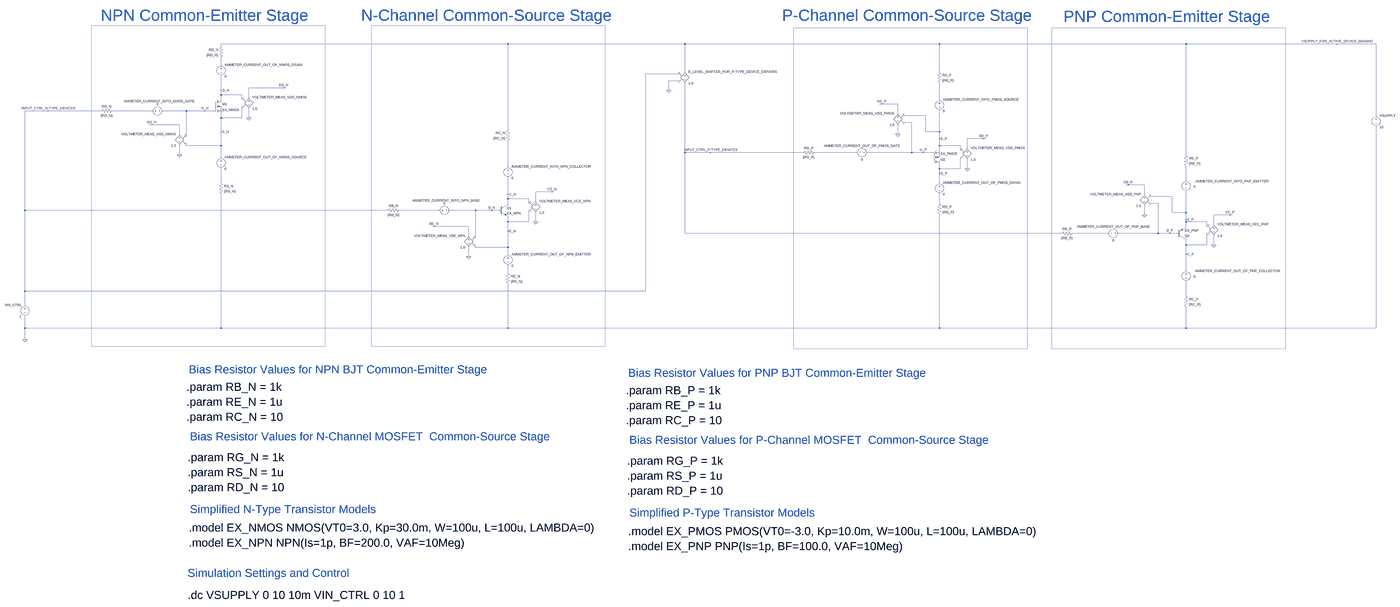
[diagram p0: schematic Common_Emitter_Common_Source_Test_Bench_for_Beginners.asc, whole sheet]
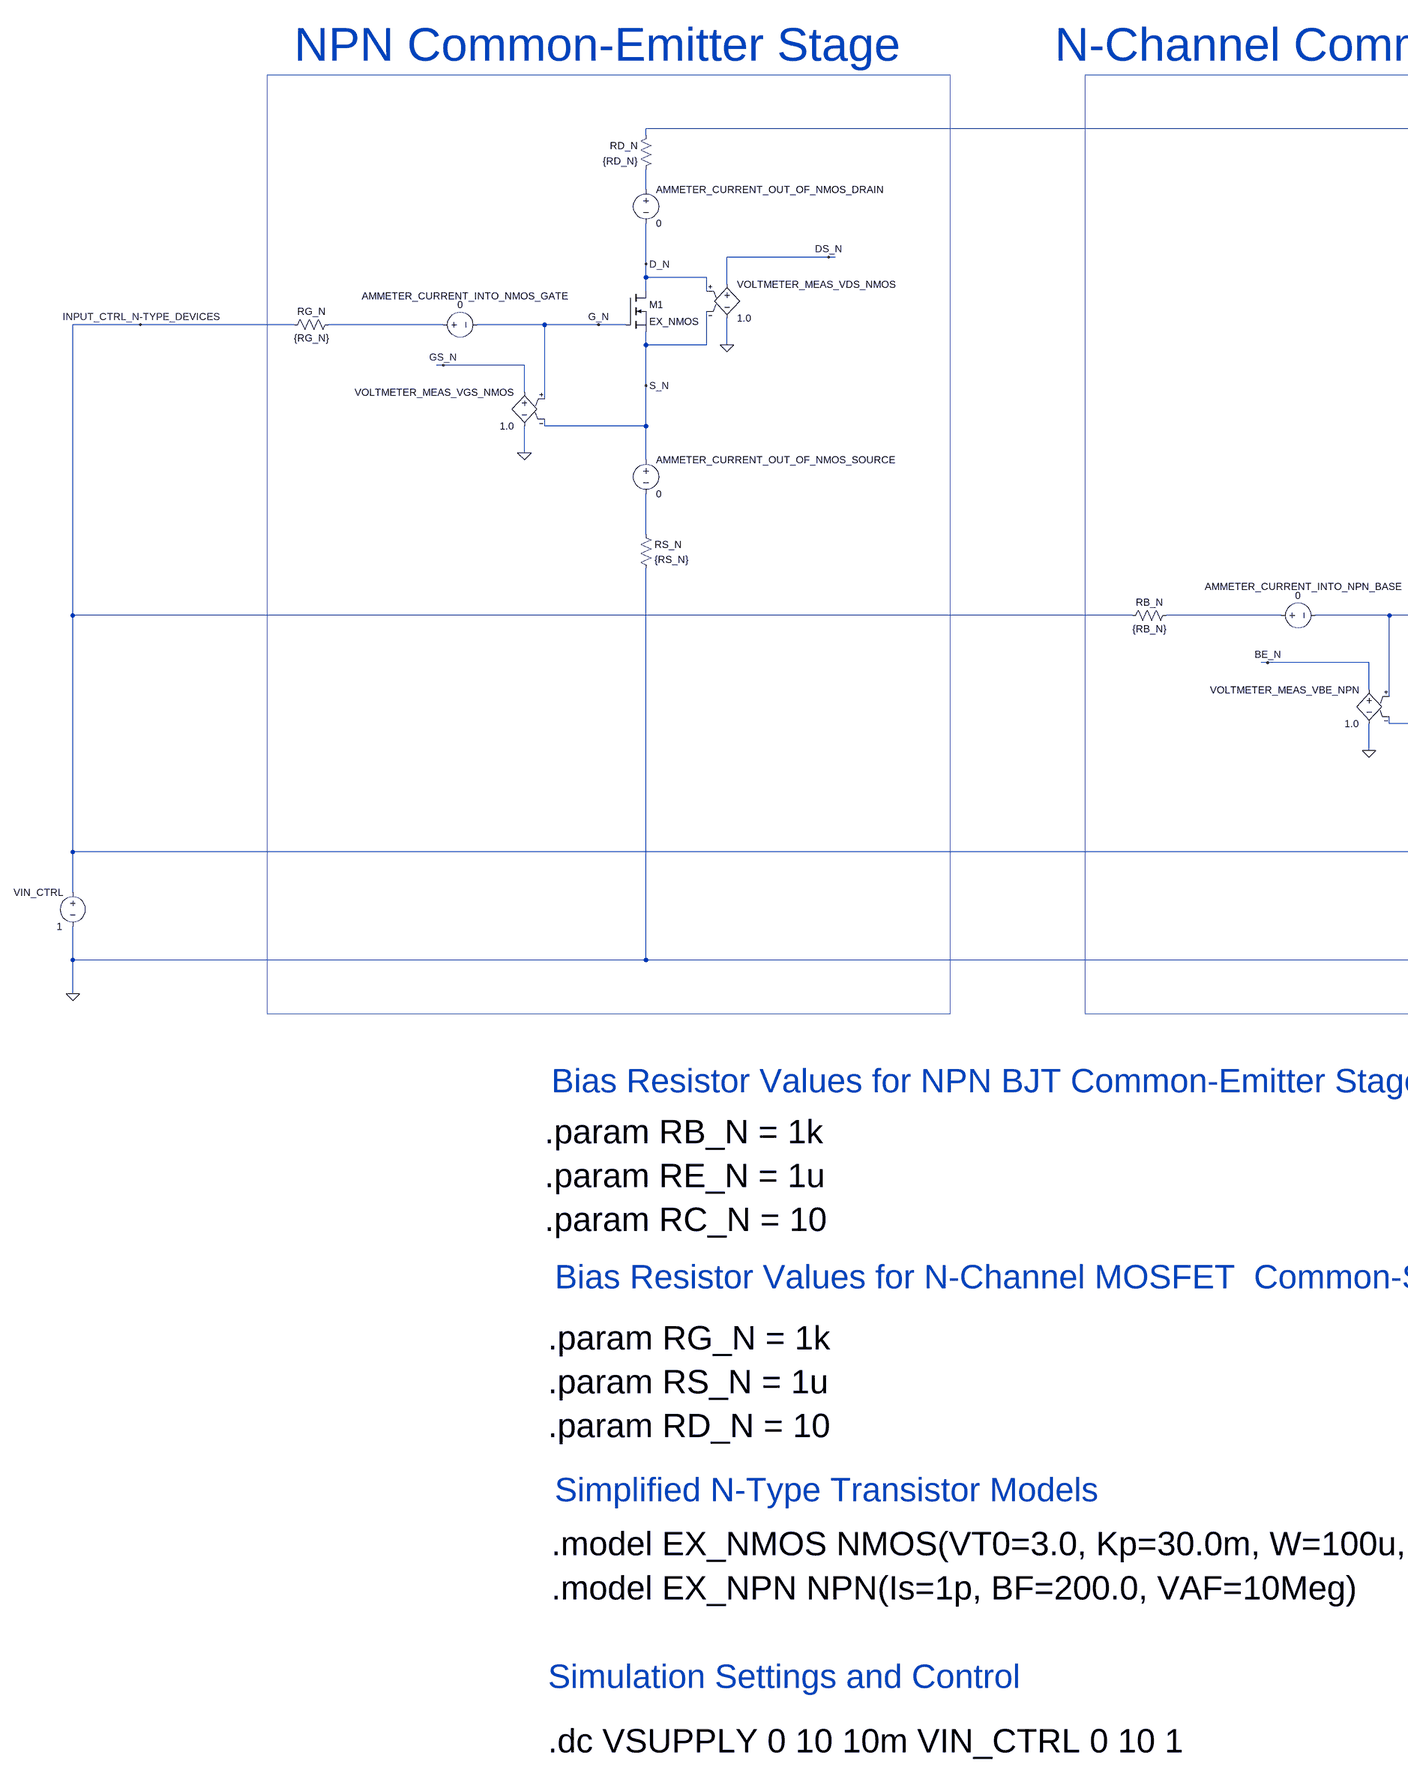
[diagram p1: schematic Common_Emitter_Common_Source_Test_Bench_for_Beginners.asc, part, row 1 of 1, column 1 of 3]
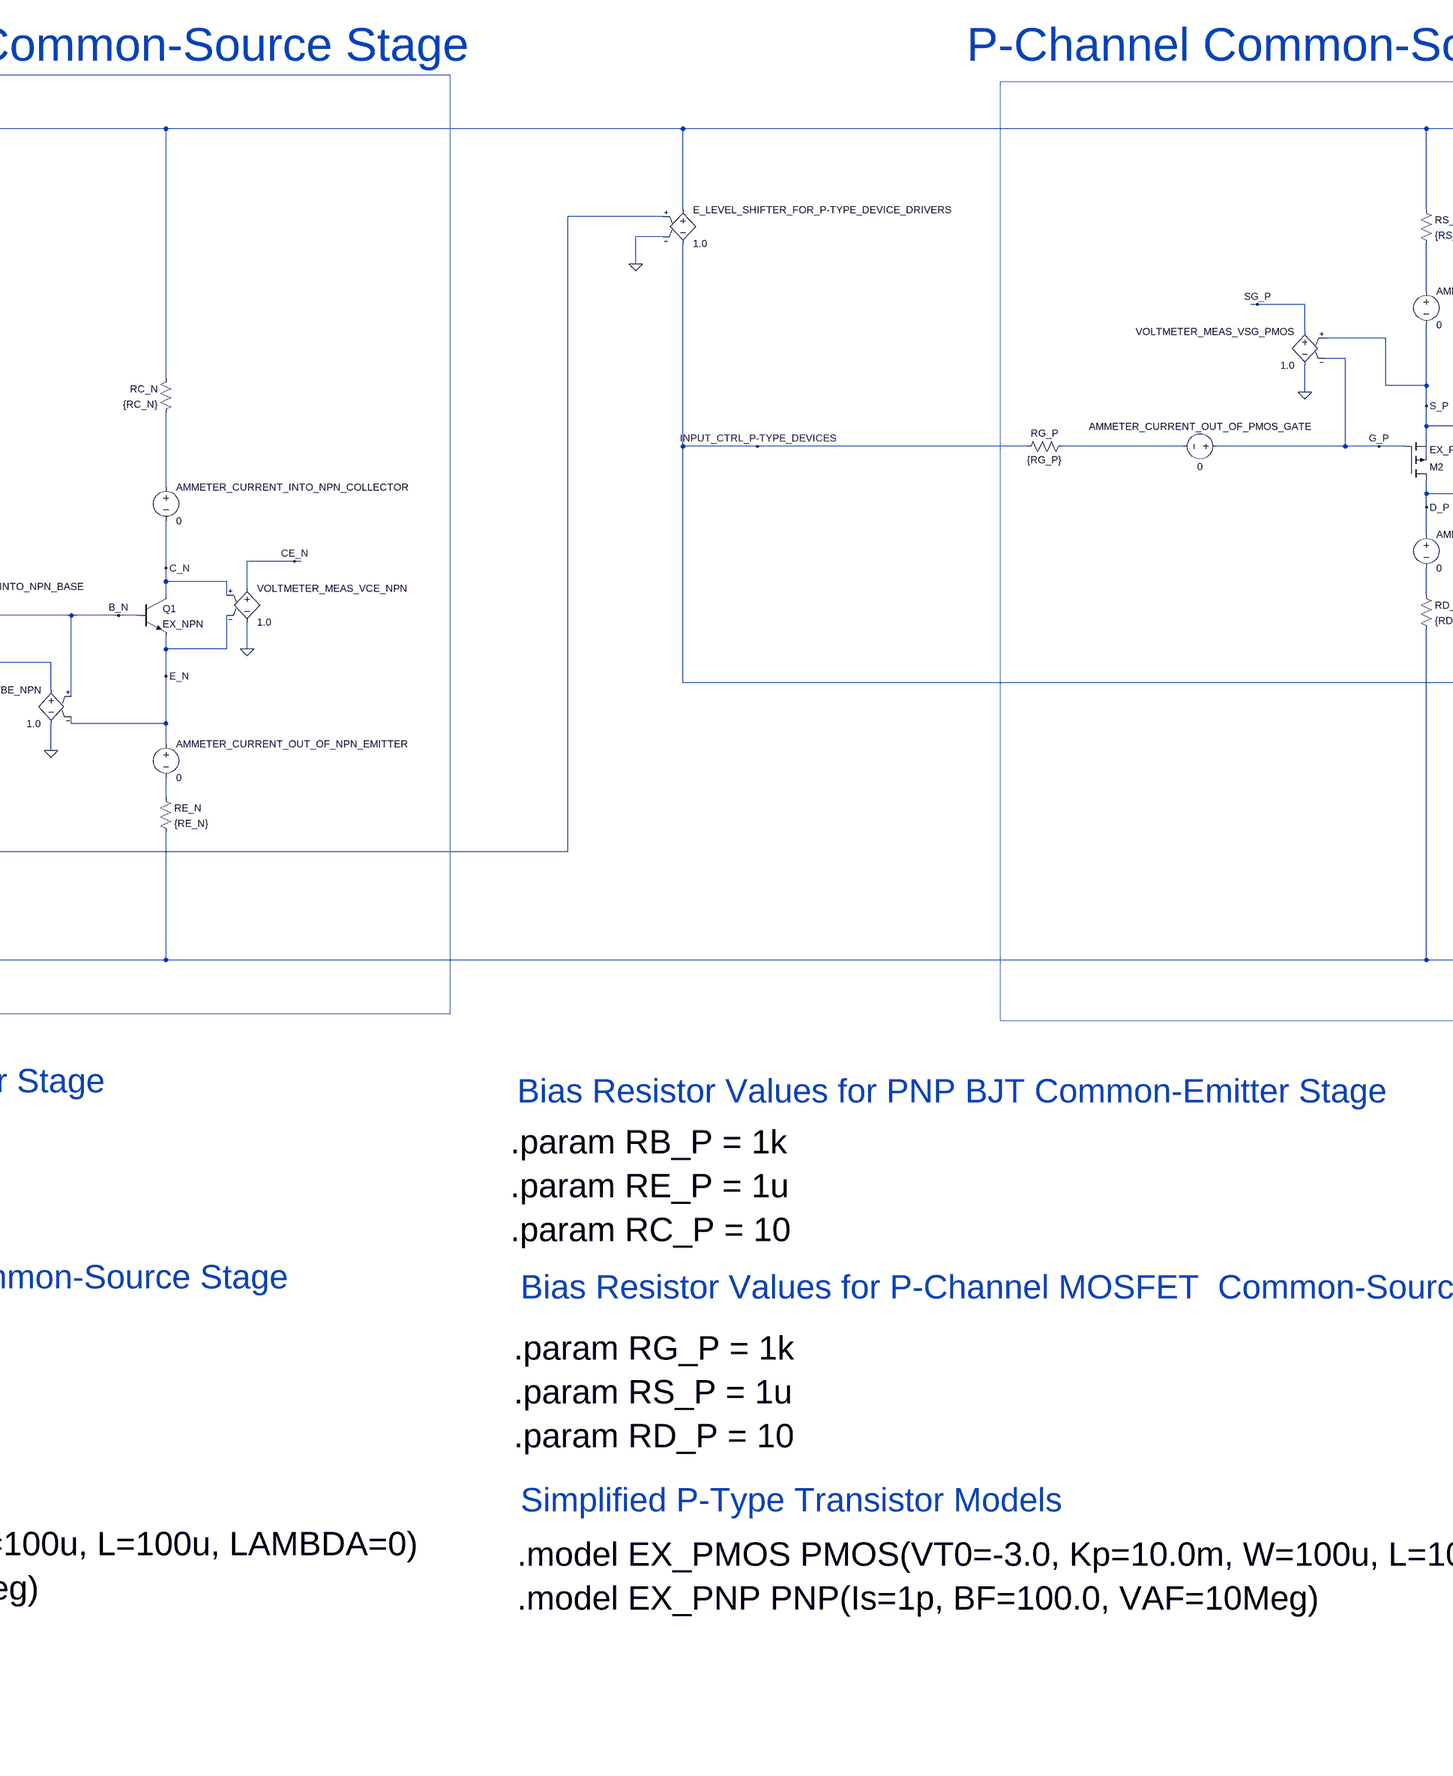
[diagram p2: schematic Common_Emitter_Common_Source_Test_Bench_for_Beginners.asc, part, row 1 of 1, column 2 of 3]
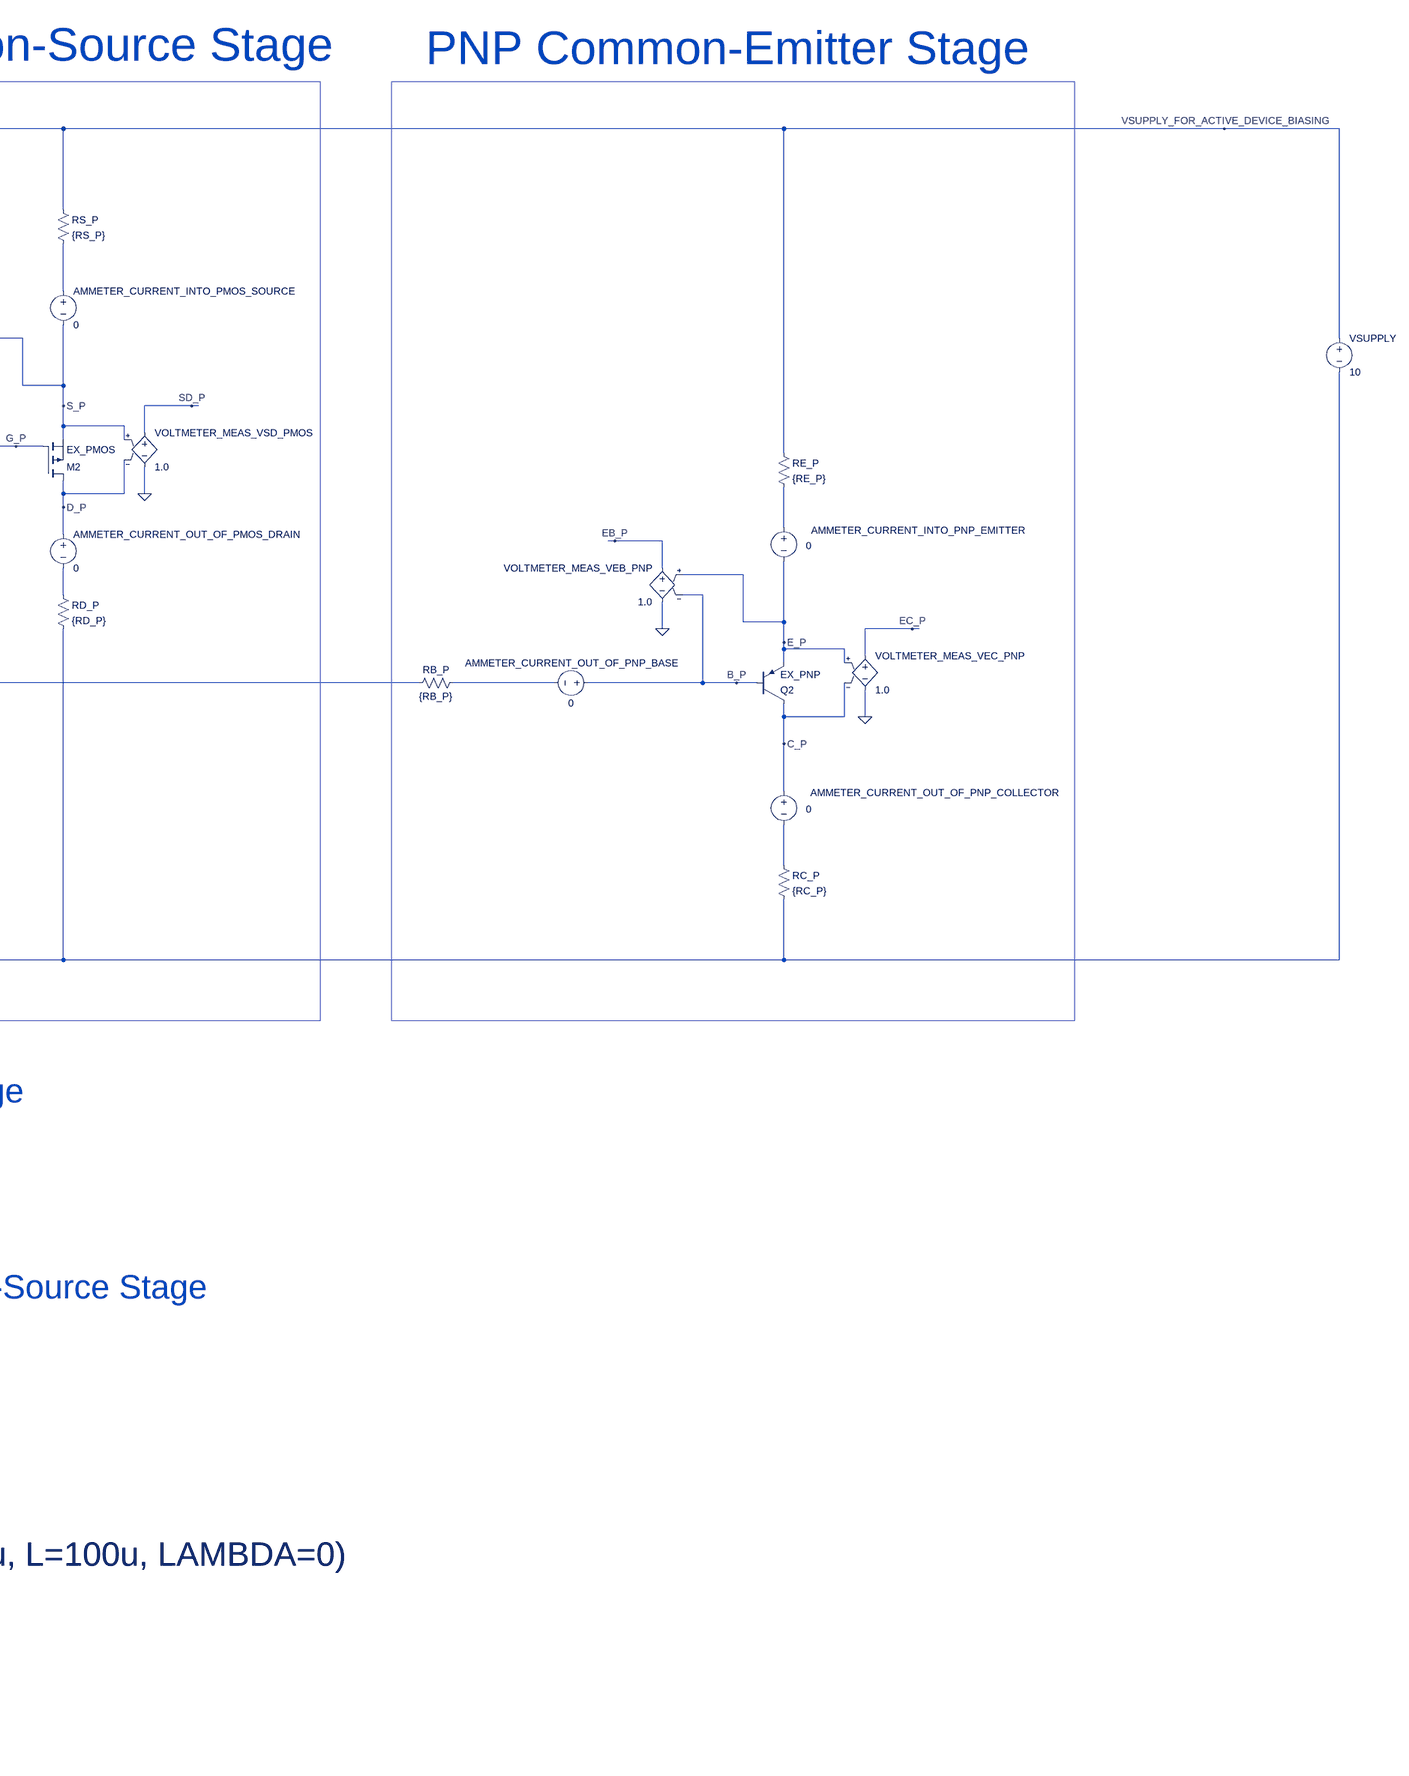
[diagram p3: schematic Common_Emitter_Common_Source_Test_Bench_for_Beginners.asc, part, row 1 of 1, column 3 of 3]
Common_Emitter_Common_Source_Test_Bench_for_Beginners.asc, the LTspice schematic file:
Version 4.1
SHEET 1 8076 3632
WIRE 768 -784 -1216 -784
WIRE 2368 -784 768 -784
WIRE 4128 -784 2368 -784
WIRE 6176 -784 4128 -784
WIRE 7664 -784 6176 -784
WIRE 7936 -784 7664 -784
WIRE -1216 -768 -1216 -784
WIRE -1216 -640 -1216 -688
WIRE 2368 -592 2368 -784
WIRE 4128 -592 4128 -784
WIRE 2320 -576 2096 -576
WIRE 2320 -528 2256 -528
WIRE -784 -480 -1024 -480
WIRE -768 -480 -784 -480
WIRE -1216 -464 -1216 -560
WIRE 2256 -464 2256 -528
WIRE -1216 -432 -1216 -464
WIRE -1072 -432 -1216 -432
WIRE -1024 -416 -1024 -480
WIRE -1216 -400 -1216 -432
WIRE -1072 -400 -1072 -432
WIRE 4128 -400 4128 -512
WIRE 3728 -368 3712 -368
WIRE 3840 -368 3728 -368
WIRE -2864 -320 -3024 -320
WIRE -2048 -320 -2864 -320
WIRE -1696 -320 -1968 -320
WIRE -1456 -320 -1616 -320
WIRE -1328 -320 -1456 -320
WIRE -1264 -320 -1328 -320
WIRE 3840 -304 3840 -368
WIRE 4032 -288 3888 -288
WIRE 7936 -288 7936 -784
WIRE -1216 -272 -1216 -304
WIRE -1072 -272 -1072 -352
WIRE -1072 -272 -1216 -272
WIRE -1024 -272 -1024 -336
WIRE 3936 -240 3888 -240
WIRE -1696 -224 -1712 -224
WIRE -1504 -224 -1696 -224
WIRE 768 -192 768 -784
WIRE -1216 -176 -1216 -272
WIRE 4032 -176 4032 -288
WIRE 4128 -176 4128 -320
WIRE 4128 -176 4032 -176
WIRE -1504 -160 -1504 -224
WIRE 3840 -160 3840 -224
WIRE -1456 -144 -1456 -320
WIRE 4128 -128 4128 -176
WIRE 4432 -128 4320 -128
WIRE 4448 -128 4432 -128
WIRE -1456 -80 -1456 -96
WIRE -1216 -80 -1216 -176
WIRE -1216 -80 -1456 -80
WIRE 4128 -80 4128 -128
WIRE 4272 -80 4128 -80
WIRE 4320 -64 4320 -128
WIRE 4128 -48 4128 -80
WIRE 4272 -48 4272 -80
WIRE 2368 -32 2368 -512
WIRE 2544 -32 2368 -32
WIRE 3184 -32 2544 -32
WIRE 3552 -32 3264 -32
WIRE 3936 -32 3936 -240
WIRE 3936 -32 3632 -32
WIRE 4016 -32 3936 -32
WIRE 4080 -32 4016 -32
WIRE -1504 -16 -1504 -80
WIRE 6176 -16 6176 -784
WIRE -1216 0 -1216 -80
WIRE 768 64 768 -112
WIRE 4128 80 4128 48
WIRE 4272 80 4272 0
WIRE 4272 80 4128 80
WIRE 4320 80 4320 16
WIRE 4128 112 4128 80
WIRE 6176 160 6176 64
WIRE -1216 176 -1216 80
WIRE 4128 176 4128 112
WIRE 5776 192 5760 192
WIRE 5888 192 5776 192
WIRE 1072 240 960 240
WIRE 1088 240 1072 240
WIRE 768 256 768 144
WIRE 5888 256 5888 192
WIRE 6080 272 5936 272
WIRE 768 288 768 256
WIRE 912 288 768 288
WIRE 960 304 960 240
WIRE 768 320 768 288
WIRE 912 320 912 288
WIRE 4128 320 4128 256
WIRE 5984 320 5936 320
WIRE -3024 368 -3024 -320
WIRE -64 368 -3024 368
WIRE 288 368 16 368
WIRE 544 368 368 368
WIRE 656 368 544 368
WIRE 704 368 656 368
WIRE 6080 384 6080 272
WIRE 6176 384 6176 240
WIRE 6176 384 6080 384
WIRE 5888 400 5888 336
WIRE 6480 400 6368 400
WIRE 6496 400 6480 400
WIRE 6176 432 6176 384
WIRE 768 448 768 416
WIRE 912 448 912 368
WIRE 912 448 768 448
WIRE 960 448 960 384
WIRE 6176 448 6176 432
WIRE 6320 448 6176 448
WIRE 6368 464 6368 400
WIRE 256 480 240 480
WIRE 496 480 256 480
WIRE 6176 480 6176 448
WIRE 6320 480 6320 448
WIRE 768 512 768 448
WIRE 2368 528 2368 -32
WIRE 5312 528 2368 528
WIRE 5632 528 5392 528
WIRE 5984 528 5984 320
WIRE 5984 528 5712 528
WIRE 6064 528 5984 528
WIRE 6112 528 6064 528
WIRE 496 544 496 480
WIRE 544 560 544 368
WIRE 6176 608 6176 576
WIRE 6320 608 6320 528
WIRE 6320 608 6176 608
WIRE 6368 608 6368 544
WIRE 544 624 544 608
WIRE 768 624 768 512
WIRE 768 624 544 624
WIRE 768 672 768 624
WIRE 6176 672 6176 608
WIRE 496 688 496 624
WIRE 6176 784 6176 672
WIRE 768 800 768 752
WIRE -3024 928 -3024 368
WIRE 2096 928 2096 -576
WIRE 2096 928 -3024 928
WIRE 6176 960 6176 864
WIRE -3024 1024 -3024 928
WIRE -3024 1184 -3024 1104
WIRE -1216 1184 -1216 256
WIRE -1216 1184 -3024 1184
WIRE 768 1184 768 880
WIRE 768 1184 -1216 1184
WIRE 4128 1184 4128 400
WIRE 4128 1184 768 1184
WIRE 6176 1184 6176 1040
WIRE 6176 1184 4128 1184
WIRE 7936 1184 7936 -208
WIRE 7936 1184 6176 1184
WIRE -3024 1264 -3024 1184
FLAG 656 368 B_N
FLAG -1328 -320 G_N
FLAG -1216 -464 D_N
FLAG 768 256 C_N
FLAG -3024 1264 0
FLAG 7664 -784 VSUPPLY_FOR_ACTIVE_DEVICE_BIASING
FLAG -2864 -320 INPUT_CTRL_N-TYPE_DEVICES
FLAG 960 448 0
FLAG 1072 240 CE_N
FLAG -1024 -272 0
FLAG -784 -480 DS_N
FLAG -1216 -176 S_N
FLAG 768 512 E_N
FLAG -1504 -16 0
FLAG -1696 -224 GS_N
FLAG 496 688 0
FLAG 256 480 BE_N
FLAG 2256 -464 0
FLAG 4016 -32 G_P
FLAG 4128 112 D_P
FLAG 4128 -128 S_P
FLAG 6064 528 B_P
FLAG 6176 672 C_P
FLAG 6176 432 E_P
FLAG 4320 80 0
FLAG 4432 -128 SD_P
FLAG 6368 608 0
FLAG 6480 400 EC_P
FLAG 5888 400 0
FLAG 5776 192 EB_P
FLAG 3840 -160 0
FLAG 3728 -368 SG_P
FLAG 2544 -32 INPUT_CTRL_P-TYPE_DEVICES
SYMBOL npn 704 320 R0
SYMATTR InstName Q1
SYMATTR Value EX_NPN
SYMBOL nmos -1264 -400 R0
SYMATTR InstName M1
SYMATTR Value EX_NMOS
SYMBOL res -80 384 R270
WINDOW 0 32 56 VTop 2
WINDOW 3 0 56 VBottom 2
SYMATTR InstName RB_N
SYMATTR Value {RB_N}
SYMBOL res -2064 -304 R270
WINDOW 0 32 56 VTop 2
WINDOW 3 0 56 VBottom 2
SYMATTR InstName RG_N
SYMATTR Value {RG_N}
SYMBOL voltage -3024 1008 M0
WINDOW 123 0 0 Left 0
WINDOW 39 0 0 Left 0
SYMATTR InstName VIN_CTRL
SYMATTR Value 1
SYMBOL res -1200 -784 M0
SYMATTR InstName RD_N
SYMATTR Value {RD_N}
SYMBOL res 784 -208 M0
SYMATTR InstName RC_N
SYMATTR Value {RC_N}
SYMBOL voltage 7936 -304 R0
WINDOW 123 0 0 Left 0
WINDOW 39 0 0 Left 0
SYMATTR InstName VSUPPLY
SYMATTR Value 10
SYMBOL res 752 784 R0
SYMATTR InstName RE_N
SYMATTR Value {RE_N}
SYMBOL res -1232 160 R0
SYMATTR InstName RS_N
SYMATTR Value {RS_N}
SYMBOL e 960 288 R0
SYMATTR InstName VOLTMETER_MEAS_VCE_NPN
SYMATTR Value 1.0
SYMBOL e -1024 -432 R0
SYMATTR InstName VOLTMETER_MEAS_VDS_NMOS
SYMATTR Value 1.0
SYMBOL e -1504 -176 M0
SYMATTR InstName VOLTMETER_MEAS_VGS_NMOS
SYMATTR Value 1.0
SYMBOL e 496 528 M0
SYMATTR InstName VOLTMETER_MEAS_VBE_NPN
SYMATTR Value 1.0
SYMBOL e 2368 -608 R0
SYMATTR InstName E_LEVEL_SHIFTER_FOR_P-TYPE_DEVICE_DRIVERS
SYMATTR Value 1.0
SYMBOL res 5408 512 R90
WINDOW 0 0 56 VBottom 2
WINDOW 3 32 56 VTop 2
SYMATTR InstName RB_P
SYMATTR Value {RB_P}
SYMBOL res 3280 -48 R90
WINDOW 0 0 56 VBottom 2
WINDOW 3 32 56 VTop 2
SYMATTR InstName RG_P
SYMATTR Value {RG_P}
SYMBOL res 4112 304 R0
SYMATTR InstName RD_P
SYMATTR Value {RD_P}
SYMBOL res 4112 -608 R0
SYMATTR InstName RS_P
SYMATTR Value {RS_P}
SYMBOL pmos 4080 48 M180
SYMATTR InstName M2
SYMATTR Value EX_PMOS
SYMBOL res 6160 944 R0
SYMATTR InstName RC_P
SYMATTR Value {RC_P}
SYMBOL res 6160 -32 R0
SYMATTR InstName RE_P
SYMATTR Value {RE_P}
SYMBOL pnp 6112 576 M180
SYMATTR InstName Q2
SYMATTR Value EX_PNP
SYMBOL e 4320 -80 R0
SYMATTR InstName VOLTMETER_MEAS_VSD_PMOS
SYMATTR Value 1.0
SYMBOL e 6368 448 R0
SYMATTR InstName VOLTMETER_MEAS_VEC_PNP
SYMATTR Value 1.0
SYMBOL e 5888 240 M0
SYMATTR InstName VOLTMETER_MEAS_VEB_PNP
SYMATTR Value 1.0
SYMBOL e 3840 -320 M0
SYMATTR InstName VOLTMETER_MEAS_VSG_PMOS
SYMATTR Value 1.0
SYMBOL voltage 5728 528 R90
WINDOW 0 -32 56 VBottom 2
WINDOW 3 32 56 VTop 2
WINDOW 123 0 0 Left 0
WINDOW 39 0 0 Left 0
SYMATTR InstName AMMETER_CURRENT_OUT_OF_PNP_BASE
SYMATTR Value 0
SYMBOL voltage 6176 768 R0
WINDOW 0 355 35 Bottom 2
WINDOW 3 59 43 Top 2
WINDOW 123 0 0 Left 0
WINDOW 39 0 0 Left 0
SYMATTR InstName AMMETER_CURRENT_OUT_OF_PNP_COLLECTOR
SYMATTR Value 0
SYMBOL voltage 6176 144 R0
WINDOW 0 316 38 Bottom 2
WINDOW 3 59 43 Top 2
WINDOW 123 0 0 Left 0
WINDOW 39 0 0 Left 0
SYMATTR InstName AMMETER_CURRENT_INTO_PNP_EMITTER
SYMATTR Value 0
SYMBOL voltage 3648 -32 R90
WINDOW 0 -32 56 VBottom 2
WINDOW 3 32 56 VTop 2
WINDOW 123 0 0 Left 0
WINDOW 39 0 0 Left 0
SYMATTR InstName AMMETER_CURRENT_OUT_OF_PMOS_GATE
SYMATTR Value 0
SYMBOL voltage 4128 160 R0
WINDOW 123 0 0 Left 0
WINDOW 39 0 0 Left 0
SYMATTR InstName AMMETER_CURRENT_OUT_OF_PMOS_DRAIN
SYMATTR Value 0
SYMBOL voltage 4128 -416 R0
WINDOW 123 0 0 Left 0
WINDOW 39 0 0 Left 0
SYMATTR InstName AMMETER_CURRENT_INTO_PMOS_SOURCE
SYMATTR Value 0
SYMBOL voltage 272 368 R270
WINDOW 0 84 66 VBottom 2
WINDOW 3 32 56 VTop 2
WINDOW 123 0 0 Left 0
WINDOW 39 0 0 Left 0
SYMATTR InstName AMMETER_CURRENT_INTO_NPN_BASE
SYMATTR Value 0
SYMBOL voltage 768 48 R0
WINDOW 123 0 0 Left 0
WINDOW 39 0 0 Left 0
SYMATTR InstName AMMETER_CURRENT_INTO_NPN_COLLECTOR
SYMATTR Value 0
SYMBOL voltage 768 656 R0
WINDOW 123 0 0 Left 0
WINDOW 39 0 0 Left 0
SYMATTR InstName AMMETER_CURRENT_OUT_OF_NPN_EMITTER
SYMATTR Value 0
SYMBOL voltage -1216 -16 R0
WINDOW 123 0 0 Left 0
WINDOW 39 0 0 Left 0
SYMATTR InstName AMMETER_CURRENT_OUT_OF_NMOS_SOURCE
SYMATTR Value 0
SYMBOL voltage -1216 -656 R0
WINDOW 123 0 0 Left 0
WINDOW 39 0 0 Left 0
SYMATTR InstName AMMETER_CURRENT_OUT_OF_NMOS_DRAIN
SYMATTR Value 0
SYMBOL voltage -1712 -320 R270
WINDOW 0 84 66 VBottom 2
WINDOW 3 32 56 VTop 2
WINDOW 123 0 0 Left 0
WINDOW 39 0 0 Left 0
SYMATTR InstName AMMETER_CURRENT_INTO_NMOS_GATE
SYMATTR Value 0
TEXT -1456 1656 Left 6 !.param RB_N = 1k\n.param RE_N = 1u\n.param RC_N = 10
TEXT -1448 2144 Left 6 !.param RG_N = 1k\n.param RS_N = 1u\n.param RD_N = 10
TEXT -1440 1536 Left 6 ;Bias Resistor Values for NPN BJT Common-Emitter Stage
TEXT -1432 2000 Left 6 ;Bias Resistor Values for N-Channel MOSFET  Common-Source Stage
TEXT -1440 2632 Left 6 !.model EX_NMOS NMOS(VT0=3.0, Kp=30.0m, W=100u, L=100u, LAMBDA=0)\n.model EX_NPN NPN(Is=1p, BF=200.0, VAF=10Meg)
TEXT -1432 2504 Left 6 ;Simplified N-Type Transistor Models
TEXT -1448 3288 Left 6 !.dc VSUPPLY 0 10 10m VIN_CTRL 0 10 1
TEXT -1448 3136 Left 6 ;Simulation Settings and Control
TEXT 1960 1680 Left 6 !.param RB_P = 1k\n.param RE_P = 1u\n.param RC_P = 10
TEXT 1968 2168 Left 6 !.param RG_P = 1k\n.param RS_P = 1u\n.param RD_P = 10
TEXT 1976 1560 Left 6 ;Bias Resistor Values for PNP BJT Common-Emitter Stage
TEXT 1984 2024 Left 6 ;Bias Resistor Values for P-Channel MOSFET  Common-Source Stage
TEXT 1976 2656 Left 6 !.model EX_PMOS PMOS(VT0=-3.0, Kp=10.0m, W=100u, L=100u, LAMBDA=0)\n.model EX_PNP PNP(Is=1p, BF=100.0, VAF=10Meg)
TEXT 1984 2528 Left 6 ;Simplified P-Type Transistor Models
TEXT -2048 -984 Left 7 ;NPN Common-Emitter Stage
TEXT -248 -984 Left 7 ;N-Channel Common-Source Stage
TEXT 5328 -976 Left 7 ;PNP Common-Emitter Stage
TEXT 3040 -984 Left 7 ;P-Channel Common-Source Stage
RECTANGLE Normal -496 1312 -2112 -912
RECTANGLE Normal 1440 1312 -176 -912
RECTANGLE Normal 4736 1328 3120 -896
RECTANGLE Normal 6864 1328 5248 -896

The netlist it stands for:
* Common_Emitter_Common_Source_Test_Bench_for_Beginners.asc
Q1 C_N B_N E_N 0 EX_NPN
M1 D_N G_N S_N S_N EX_NMOS
RB_N INPUT_CTRL_N-TYPE_DEVICES N009 {RB_N}
RG_N INPUT_CTRL_N-TYPE_DEVICES N003 {RG_N}
VIN_CTRL INPUT_CTRL_N-TYPE_DEVICES 0 1
RD_N VSUPPLY_FOR_ACTIVE_DEVICE_BIASING N001 {RD_N}
RC_N VSUPPLY_FOR_ACTIVE_DEVICE_BIASING N005 {RC_N}
VSUPPLY VSUPPLY_FOR_ACTIVE_DEVICE_BIASING 0 10
RE_N N011 0 {RE_N}
RS_N N007 0 {RS_N}
E§VOLTMETER_MEAS_VCE_NPN CE_N 0 C_N E_N 1.0
E§VOLTMETER_MEAS_VDS_NMOS DS_N 0 D_N S_N 1.0
E§VOLTMETER_MEAS_VGS_NMOS GS_N 0 G_N S_N 1.0
E§VOLTMETER_MEAS_VBE_NPN BE_N 0 B_N E_N 1.0
E_LEVEL_SHIFTER_FOR_P-TYPE_DEVICE_DRIVERS VSUPPLY_FOR_ACTIVE_DEVICE_BIASING INPUT_CTRL_P-TYPE_DEVICES INPUT_CTRL_N-TYPE_DEVICES 0 1.0
RB_P N010 INPUT_CTRL_P-TYPE_DEVICES {RB_P}
RG_P N004 INPUT_CTRL_P-TYPE_DEVICES {RG_P}
RD_P N008 0 {RD_P}
RS_P VSUPPLY_FOR_ACTIVE_DEVICE_BIASING N002 {RS_P}
M2 D_P G_P S_P S_P EX_PMOS
RC_P N012 0 {RC_P}
RE_P VSUPPLY_FOR_ACTIVE_DEVICE_BIASING N006 {RE_P}
Q2 C_P B_P E_P 0 EX_PNP
E§VOLTMETER_MEAS_VSD_PMOS SD_P 0 S_P D_P 1.0
E§VOLTMETER_MEAS_VEC_PNP EC_P 0 E_P C_P 1.0
E§VOLTMETER_MEAS_VEB_PNP EB_P 0 E_P B_P 1.0
E§VOLTMETER_MEAS_VSG_PMOS SG_P 0 S_P G_P 1.0
V§AMMETER_CURRENT_OUT_OF_PNP_BASE B_P N010 0
V§AMMETER_CURRENT_OUT_OF_PNP_COLLECTOR C_P N012 0
V§AMMETER_CURRENT_INTO_PNP_EMITTER N006 E_P 0
V§AMMETER_CURRENT_OUT_OF_PMOS_GATE G_P N004 0
V§AMMETER_CURRENT_OUT_OF_PMOS_DRAIN D_P N008 0
V§AMMETER_CURRENT_INTO_PMOS_SOURCE N002 S_P 0
V§AMMETER_CURRENT_INTO_NPN_BASE N009 B_N 0
V§AMMETER_CURRENT_INTO_NPN_COLLECTOR N005 C_N 0
V§AMMETER_CURRENT_OUT_OF_NPN_EMITTER E_N N011 0
V§AMMETER_CURRENT_OUT_OF_NMOS_SOURCE S_N N007 0
V§AMMETER_CURRENT_OUT_OF_NMOS_DRAIN N001 D_N 0
V§AMMETER_CURRENT_INTO_NMOS_GATE N003 G_N 0
.model NPN NPN
.model PNP PNP
.lib standard.bjt
.model NMOS NMOS
.model PMOS PMOS
.lib standard.mos
.param RB_N = 1k
.param RE_N = 1u
.param RC_N = 10
.param RG_N = 1k
.param RS_N = 1u
.param RD_N = 10
* Bias Resistor Values for NPN BJT Common-Emitter Stage
* Bias Resistor Values for N-Channel MOSFET  Common-Source Stage
.model EX_NMOS NMOS(VT0=3.0, Kp=30.0m, W=100u, L=100u, LAMBDA=0)
.model EX_NPN NPN(Is=1p, BF=200.0, VAF=10Meg)
* Simplified N-Type Transistor Models
.dc VSUPPLY 0 10 10m VIN_CTRL 0 10 1
* Simulation Settings and Control
.param RB_P = 1k
.param RE_P = 1u
.param RC_P = 10
.param RG_P = 1k
.param RS_P = 1u
.param RD_P = 10
* Bias Resistor Values for PNP BJT Common-Emitter Stage
* Bias Resistor Values for P-Channel MOSFET  Common-Source Stage
.model EX_PMOS PMOS(VT0=-3.0, Kp=10.0m, W=100u, L=100u, LAMBDA=0)
.model EX_PNP PNP(Is=1p, BF=100.0, VAF=10Meg)
* Simplified P-Type Transistor Models
* NPN Common-Emitter Stage
* N-Channel Common-Source Stage
* PNP Common-Emitter Stage
* P-Channel Common-Source Stage
.backanno
.end